# EAGLE design Teensy41Memory (EAGLE 7.4.0)
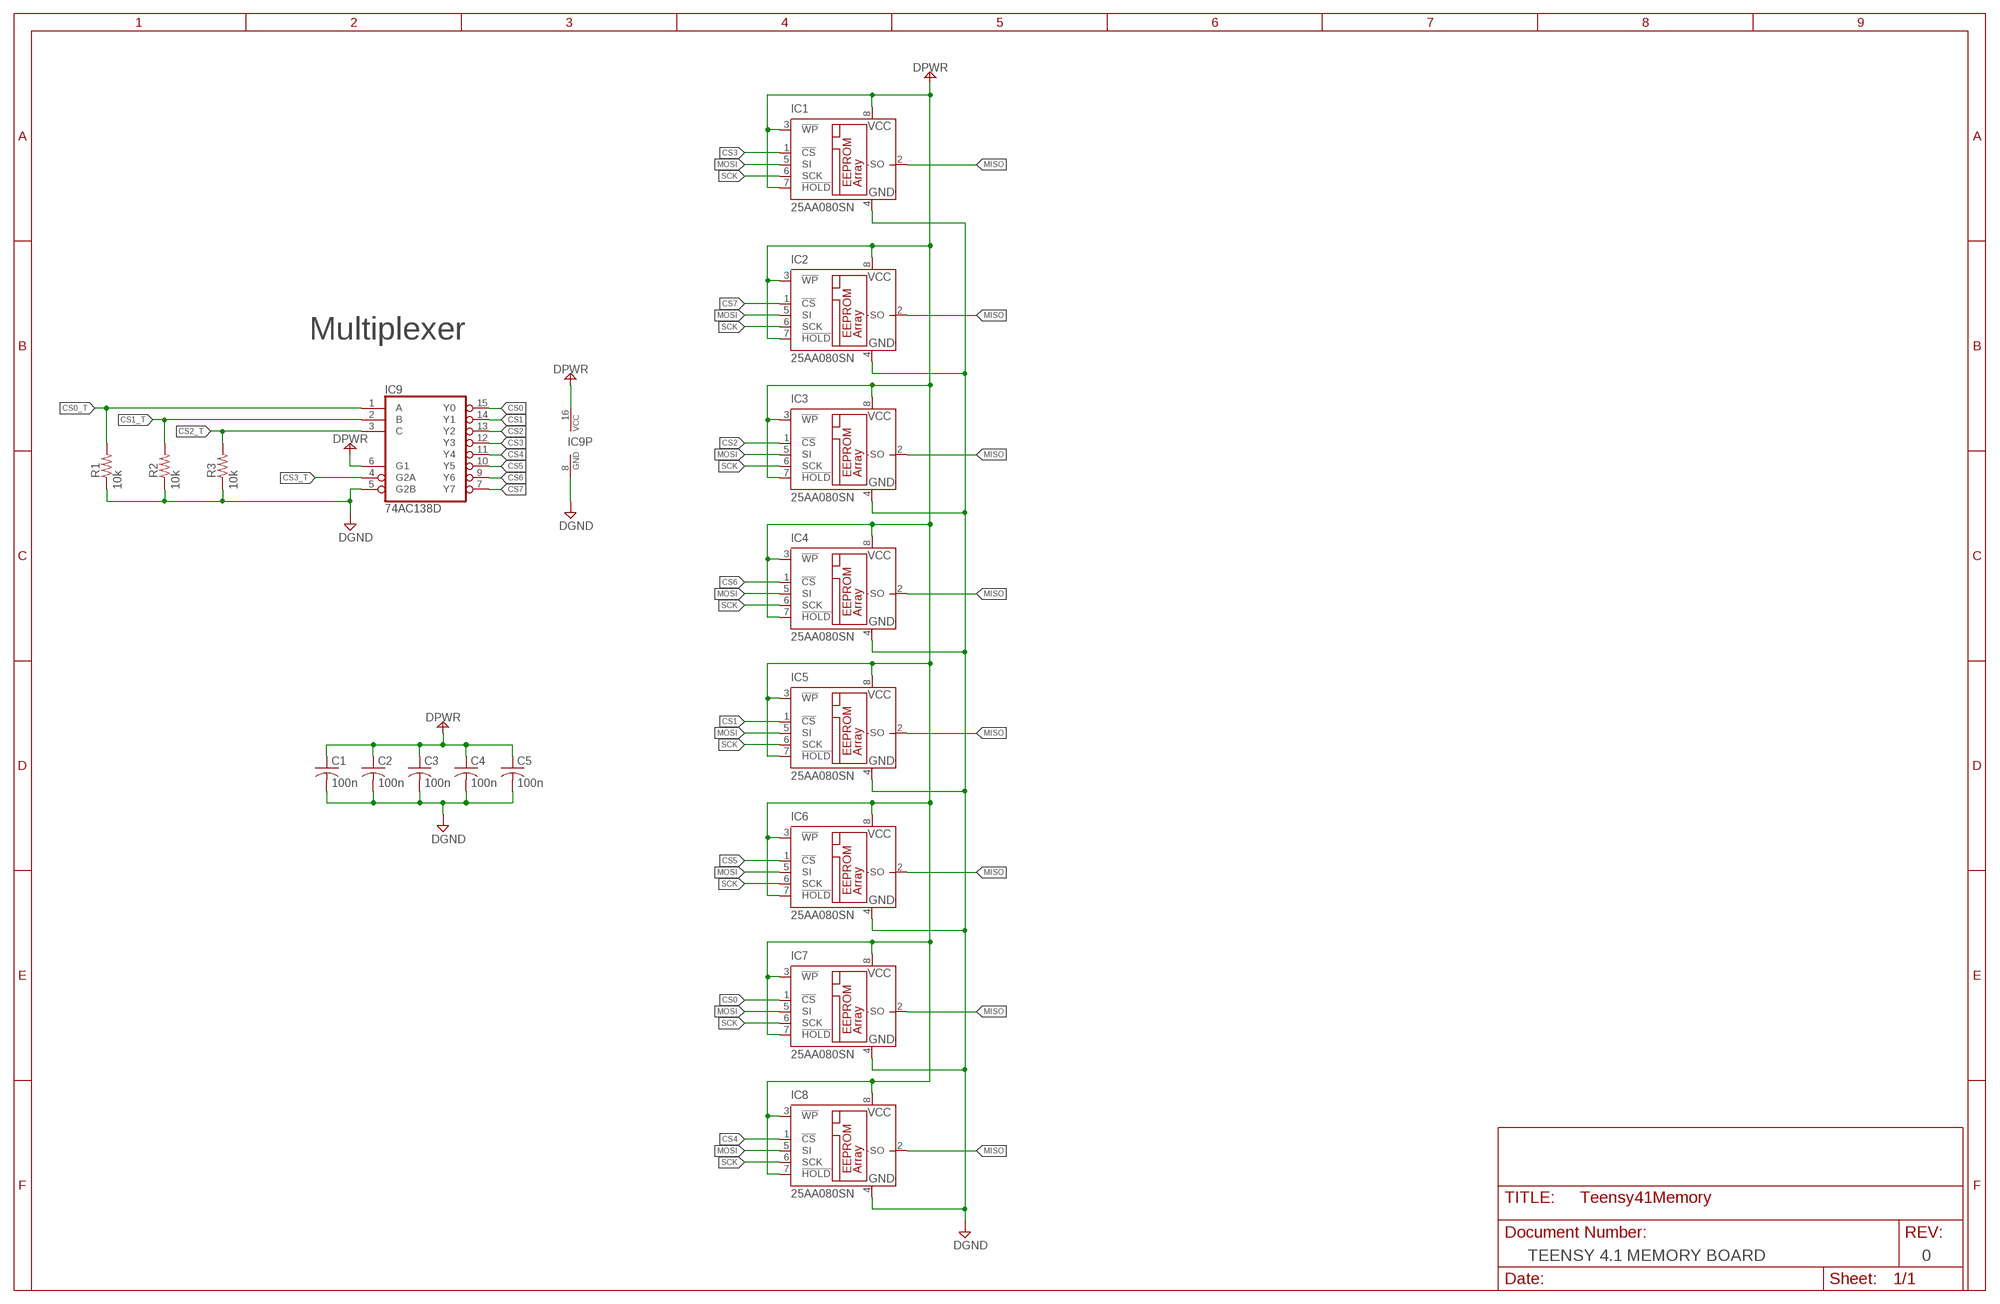
[diagram p0: schematic, sheet 1]

## Parts
C1  100n  CB  [C0603]
C2  100n  CB  [C0603]
C3  100n  CB  [C0603]
C4  100n  CB  [C0603]
C5  100n  CB  [C0603]
IC1  25AA080SN  [SO-08]
IC2  25AA080SN  [SO-08]
IC3  25AA080SN  [SO-08]
IC4  25AA080SN  [SO-08]
IC5  25AA080SN  [SO-08]
IC6  25AA080SN  [SO-08]
IC7  25AA080SN  [SO-08]
IC8  25AA080SN  [SO-08]
IC9  74AC138D  [SO16]
R1  10k  RB  [R0603]
R2  10k  RB  [R0603]
R3  10k  RB  [R0603]

## Nets
CS0: IC7.1(!CS) IC9.15(Y0)
CS0_T: IC9.1(A) R1.2
CS1: IC5.1(!CS) IC9.14(Y1)
CS1_T: IC9.2(B) R2.2
CS2: IC3.1(!CS) IC9.13(Y2)
CS2_T: IC9.3(C) R3.2
CS3: IC1.1(!CS) IC9.12(Y3)
CS3_T: IC9.4(G2A)
CS4: IC8.1(!CS) IC9.11(Y4)
CS5: IC6.1(!CS) IC9.10(Y5)
CS6: IC4.1(!CS) IC9.9(Y6)
CS7: IC2.1(!CS) IC9.7(Y7)
DGND: C1.2 C2.2 C3.2 C4.2 C5.2 IC1.4(GND) IC2.4(GND) IC3.4(GND) IC4.4(GND) IC5.4(GND) IC6.4(GND) IC7.4(GND) IC8.4(GND) IC9.5(G2B) IC9.8(GND) R1.1 R2.1 R3.1
DPWR: C1.1 C2.1 C3.1 C4.1 C5.1 IC1.3(!WP) IC1.7(!HOLD) IC1.8(VCC) IC2.3(!WP) IC2.7(!HOLD) IC2.8(VCC) IC3.3(!WP) IC3.7(!HOLD) IC3.8(VCC) IC4.3(!WP) IC4.7(!HOLD) IC4.8(VCC) IC5.3(!WP) IC5.7(!HOLD) IC5.8(VCC) IC6.3(!WP) IC6.7(!HOLD) IC6.8(VCC) IC7.3(!WP) IC7.7(!HOLD) IC7.8(VCC) IC8.3(!WP) IC8.7(!HOLD) IC8.8(VCC) IC9.6(G1) IC9.16(VCC)
MISO: IC1.2(SO) IC2.2(SO) IC3.2(SO) IC4.2(SO) IC5.2(SO) IC6.2(SO) IC7.2(SO) IC8.2(SO)
MOSI: IC1.5(SI) IC2.5(SI) IC3.5(SI) IC4.5(SI) IC5.5(SI) IC6.5(SI) IC7.5(SI) IC8.5(SI)
SCK: IC1.6(SCK) IC2.6(SCK) IC3.6(SCK) IC4.6(SCK) IC5.6(SCK) IC6.6(SCK) IC7.6(SCK) IC8.6(SCK)

## Notes on the sheet
- Multiplexer
- TEENSY 4.1 MEMORY BOARD | 0

## Library data of the parts
C1-C5 = studio_h:C: Non-Polarized Capacitor; Z_SMT: Y
IC1-IC8 = microchip:25*: Serial EEPROM 4K/ 8K , SPI bus; MF: MICROCHIP; MPN: 25AA080/SN; OC_FARNELL: 1816072; OC_NEWARK: 92C7351
IC9 = 74xx-eu:74*138: 3-line to 8-line DECODER/DEMULTIPLEXER
R1-R3 = studio_h:R: Resistor; Z_SMT: Y

## Net classes
0 Signal: width 0.254 mm, clearance 0.205 mm
1 Power: width 0.508 mm, clearance 0.205 mm to class 0, clearance 0.205 mm
2 GND: width 0.889 mm

## Board
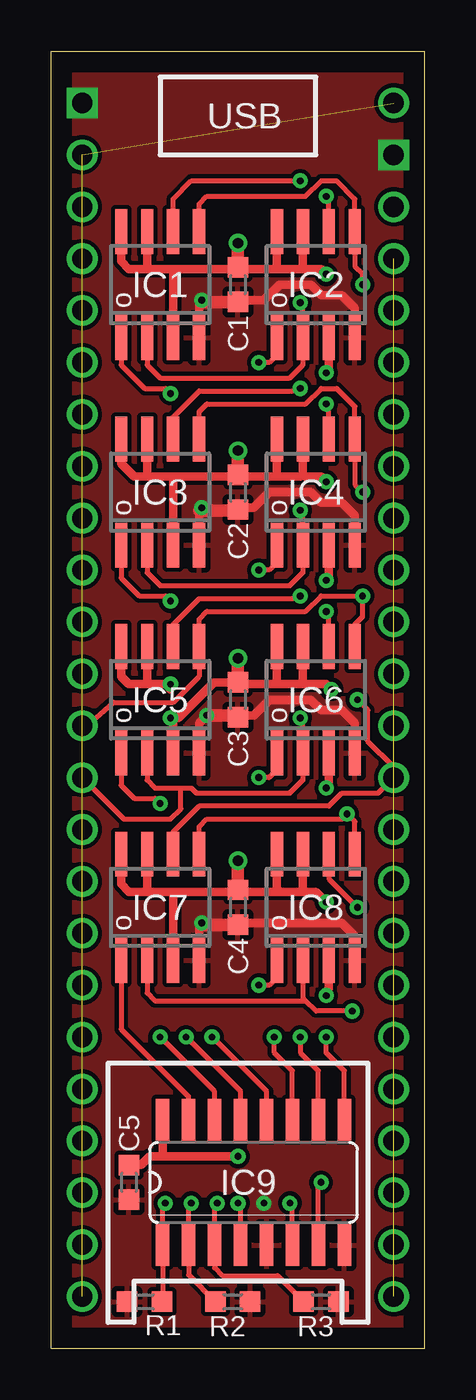
[diagram p1: board, top side]
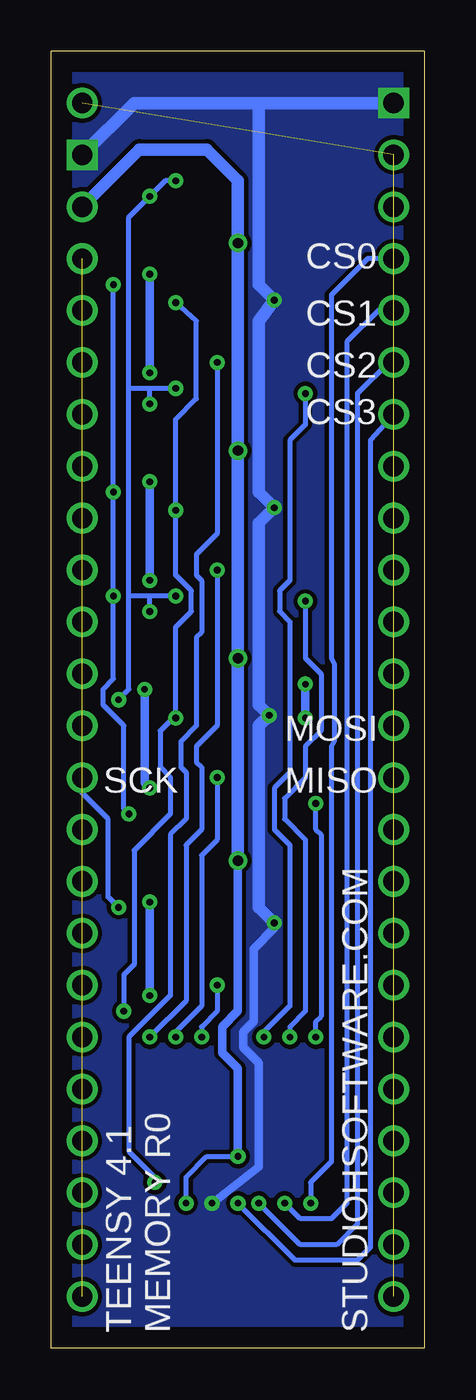
[diagram p2: board, bottom side, seen from below]

Size 18.29 x 63.5 mm. Coordinates in mm from the lower left corner, seen from the top.
Outline: 0,0 18.29,0 18.29,63.5 0,63.5 0,0
Copper layers (1*16): Top 0.035mm / dielectric 0.2mm / Bottom 0.035mm
Design rules "default *": minimum track width 10mil, minimum drill 20mil, track to track 8mil, track to pad 8mil, pad to pad 8mil, via to via 8mil, smd to smd 8mil, copper to edge 40mil, drill to drill 8mil, minimum pad ring 10mil, minimum via ring 8mil, stop-mask expansion 4mil, vias tented up to drill 0mil, thermal gap 10mil
bKeepout: area 20.6,155.1 to 26.9,165.3
bRestrict: area 20.6,155.1 to 26.9,165.3

### Footprints (pad centres in the part's own frame; a part is rotated, then mirrored left to right if it is on the bottom)
C0603 = smd 1 x 1: 1 -0.85,0; 2 0.85,0
SO-08 = smd 0.6 x 2.2: 1 -1.905,-2.6; 2 -0.635,-2.6; 3 0.635,-2.6; 4 1.905,-2.6; 5 1.905,2.6; 6 0.635,2.6; 7 -0.635,2.6; 8 -1.905,2.6
SO16 = smd 0.66 x 2.032: 1 -4.445,-3.073; 2 -3.175,-3.073; 3 -1.905,-3.073; 4 -0.635,-3.073; 5 0.635,-3.073; 6 1.905,-3.073; 7 3.175,-3.073; 8 4.445,-3.073; 9 4.445,3.073; 10 3.175,3.073; 11 1.905,3.073; 12 0.635,3.073; 13 -0.635,3.073; 14 -1.905,3.073; 15 -3.175,3.073; 16 -4.445,3.073
R0603 = smd 1 x 1: 1 -0.85,0; 2 0.85,0

### Placement (x,y rotation side)
C1  9.14,52.07 270 top
C2  9.14,41.91 270 top
C3  9.14,31.75 270 top
C4  9.14,21.59 270 top
C5  3.81,8.13 270 top
IC1  5.33,52.07 0 top
IC2  12.95,52.07 0 top
IC3  5.33,41.91 0 top
IC4  12.95,41.91 0 top
IC5  5.33,31.75 0 top
IC6  12.95,31.75 0 top
IC7  5.33,21.59 0 top
IC8  12.95,21.59 0 top
IC9  9.91,8.13 0 top
R1  4.57,2.29 0 top
R2  8.89,2.29 180 top
R3  13.21,2.29 180 top
U$1  [A64CBI]  66.42,95.25 0 bottom  (outside the outline)
U$2  [W64CBI]  69.6,95.25 0 bottom  (outside the outline)
U$3  [V64CBI]  63.5,95.25 0 bottom  (outside the outline)
U$4  [E64CBI]  61.21,95.25 0 bottom  (outside the outline)
U$5  [E64CBI]  59.56,91.19 0 bottom  (outside the outline)
U$6  [S64CBI]  69.85,91.19 0 bottom  (outside the outline)
U$7  [H64CBI]  67.31,91.19 0 bottom  (outside the outline)
U$8  [A64CBI]  64.77,91.19 0 bottom  (outside the outline)
U$9  [P64CBI]  61.98,91.19 0 bottom  (outside the outline)
U$10  [A64CBI]  13.08,95.25 0 bottom  (outside the outline)
U$11  [W64CBI]  16.26,95.25 0 bottom  (outside the outline)
U$12  [V64CBI]  10.16,95.25 0 bottom  (outside the outline)
U$13  [E64CBI]  7.87,95.25 0 bottom  (outside the outline)
U$14  [E64CBI]  6.22,91.19 0 bottom  (outside the outline)
U$15  [S64CBI]  16.51,91.19 0 bottom  (outside the outline)
U$16  [H64CBI]  13.97,91.19 0 bottom  (outside the outline)
U$17  [A64CBI]  11.43,91.19 0 bottom  (outside the outline)
U$18  [P64CBI]  8.64,91.19 0 bottom  (outside the outline)
U$19  [M64CBI]  102.62,133.86 0 bottom  (outside the outline)
U$20  [O64CBI]  99.19,133.86 0 bottom  (outside the outline)
U$21  [D64CBI]  96.27,133.86 0 bottom  (outside the outline)
U$22  [I64CBI]  102.87,130.05 0 bottom  (outside the outline)
U$23  [N64CBI]  101.6,130.05 0 bottom  (outside the outline)
U$24  [D64CBI]  98.81,130.05 0 bottom  (outside the outline)
U$25  [E64CBI]  96.01,130.05 0 bottom  (outside the outline)
U$26  [X64CBI]  93.73,130.05 0 bottom  (outside the outline)
U$27  [A64CBI]  105.92,155.96 0 bottom  (outside the outline)
U$28  [M64CBI]  50.04,133.86 0 bottom  (outside the outline)
U$29  [O64CBI]  46.61,133.86 0 bottom  (outside the outline)
U$30  [D64CBI]  43.69,133.86 0 bottom  (outside the outline)
U$31  [I64CBI]  50.29,130.05 0 bottom  (outside the outline)
U$32  [N64CBI]  49.02,130.05 0 bottom  (outside the outline)
U$33  [D64CBI]  46.23,130.05 0 bottom  (outside the outline)
U$34  [E64CBI]  43.43,130.05 0 bottom  (outside the outline)
U$35  [X64CBI]  41.15,130.05 0 bottom  (outside the outline)
U$36  [B64CBI]  45.72,155.96 0 bottom  (outside the outline)
U$37  [B64CBI]  51.82,90.17 0 bottom  (outside the outline)
U$38  [A64CBI]  105.16,90.17 0 bottom  (outside the outline)
U$39  [S64CBI]  44.96,141.48 0 bottom  (outside the outline)
U$40  [Y64CBI]  42.42,141.48 0 bottom  (outside the outline)
U$41  [N64CBI]  40.13,141.48 0 bottom  (outside the outline)
U$42  [C64CBI]  37.34,141.48 0 bottom  (outside the outline)
U$43  [N64BI]  30.23,150.11 0 bottom  (outside the outline)
U$44  [O64BI]  27.94,150.11 0 bottom  (outside the outline)
U$45  [T64BI]  25.65,150.11 0 bottom  (outside the outline)
U$46  [E64BI]  24.38,150.11 0 bottom  (outside the outline)
U$47  [O64BI]  21.34,150.11 0 bottom  (outside the outline)
U$48  [N64BI]  19.3,150.11 0 bottom  (outside the outline)
U$49  [H64BI]  26.42,146.3 0 bottom  (outside the outline)
U$50  [A64BI]  24.13,146.3 0 bottom  (outside the outline)
U$51  [R64BI]  22.1,146.3 0 bottom  (outside the outline)
U$52  [D64BI]  20.57,146.3 0 bottom  (outside the outline)
U$53  [S64BI]  22.35,142.49 0 bottom  (outside the outline)
U$54  [O64BI]  20.07,142.49 0 bottom  (outside the outline)
U$55  [F64BI]  17.78,142.49 0 bottom  (outside the outline)
U$56  [T64BI]  16.26,142.49 0 bottom  (outside the outline)
U$57  [M54CBI]  43.56,150.11 0 bottom  (outside the outline)
U$58  [I54CBI]  40.89,150.11 0 bottom  (outside the outline)
U$59  [I54CBI]  37.59,150.11 0 bottom  (outside the outline)
U$60  [D54CBI]  39.88,150.11 0 bottom  (outside the outline)
U$61  [N64BI]  89.66,150.11 0 bottom  (outside the outline)
U$62  [O64BI]  87.38,150.11 0 bottom  (outside the outline)
U$63  [T64BI]  85.09,150.11 0 bottom  (outside the outline)
U$64  [E64BI]  83.82,150.11 0 bottom  (outside the outline)
U$65  [O64BI]  80.77,150.11 0 bottom  (outside the outline)
U$66  [N64BI]  78.74,150.11 0 bottom  (outside the outline)
U$67  [S64BI]  82.04,142.49 0 bottom  (outside the outline)
U$68  [O64BI]  79.76,142.49 0 bottom  (outside the outline)
U$69  [F64BI]  77.47,142.49 0 bottom  (outside the outline)
U$70  [T64BI]  75.95,142.49 0 bottom  (outside the outline)
U$71  [H64BI]  85.85,146.3 0 bottom  (outside the outline)
U$72  [A64BI]  83.57,146.3 0 bottom  (outside the outline)
U$73  [R64BI]  81.53,146.3 0 bottom  (outside the outline)
U$74  [D64BI]  80.01,146.3 0 bottom  (outside the outline)
U$75  [S64CBI]  104.39,141.48 0 bottom  (outside the outline)
U$76  [Y64CBI]  101.85,141.48 0 bottom  (outside the outline)
U$77  [N64CBI]  99.57,141.48 0 bottom  (outside the outline)
U$78  [C64CBI]  96.77,141.48 0 bottom  (outside the outline)
U$79  [M54CBI]  103,150.11 0 bottom  (outside the outline)
U$80  [I54CBI]  100.33,150.11 0 bottom  (outside the outline)
U$81  [I54CBI]  97.03,150.11 0 bottom  (outside the outline)
U$82  [D54CBI]  99.31,150.11 0 bottom  (outside the outline)
U$83  [R64BI]  57.15,159.26 0 bottom  (outside the outline)
U$84  [E64BI]  55.37,159.26 0 bottom  (outside the outline)
U$85  [M64BI]  53.34,159.26 0 bottom  (outside the outline)
U$86  [E64BI]  50.04,155.19 0 bottom  (outside the outline)
U$87  [N64BI]  57.91,155.19 0 bottom  (outside the outline)
U$88  [A64BI]  55.63,155.19 0 bottom  (outside the outline)
U$89  [B64BI]  53.59,155.19 0 bottom  (outside the outline)
U$90  [L64BI]  51.31,155.19 0 bottom  (outside the outline)
U$91  [E64BI]  59.94,155.19 0 bottom  (outside the outline)
U$92  [O64BI]  103.12,146.3 0 bottom  (outside the outline)
U$93  [S64BI]  100.84,146.3 0 bottom  (outside the outline)
U$94  [C64BI]  98.55,146.3 0 bottom  (outside the outline)
U$95  [B54CBI]  96.27,146.3 0 bottom  (outside the outline)
U$96  [O64BI]  43.69,146.3 0 bottom  (outside the outline)
U$97  [S64BI]  41.4,146.3 0 bottom  (outside the outline)
U$98  [C64BI]  39.12,146.3 0 bottom  (outside the outline)
U$99  [O64CBI]  105.16,83.57 0 bottom  (outside the outline)
U$100  [W64BI]  58.17,35.05 0 bottom  (outside the outline)
U$101  [A64BI]  55.37,35.05 0 bottom  (outside the outline)
U$102  [V64BI]  53.09,35.05 0 bottom  (outside the outline)
U$103  [E64BI]  51.05,35.05 0 bottom  (outside the outline)
U$104  [A64BI]  58.42,29.97 0 bottom  (outside the outline)
U$105  [M64BI]  56.39,29.97 0 bottom  (outside the outline)
U$106  [P64BI]  53.34,29.21 0 bottom  (outside the outline)
U$107  [F64BI]  58.42,24.38 0 bottom  (outside the outline)
U$108  [M64BI]  57.15,24.38 0 bottom  (outside the outline)
U$109  [W64BI]  58.42,73.91 0 bottom  (outside the outline)
U$110  [A64BI]  55.63,73.91 0 bottom  (outside the outline)
U$111  [V64BI]  53.34,73.91 0 bottom  (outside the outline)
U$112  [E64BI]  51.31,73.91 0 bottom  (outside the outline)
U$113  [A64BI]  56.64,68.83 0 bottom  (outside the outline)
U$114  [M64BI]  54.61,68.83 0 bottom  (outside the outline)
U$115  [P64BI]  51.56,68.07 0 bottom  (outside the outline)
U$116  [F64BI]  54.1,63.25 0 bottom  (outside the outline)
U$117  [M64BI]  52.83,63.25 0 bottom  (outside the outline)
U$118  [M64CBI]  60.45,82.04 0 bottom  (outside the outline)
U$119  [O64CBI]  57.02,82.04 0 bottom  (outside the outline)
U$120  [D64CBI]  54.1,82.04 0 bottom  (outside the outline)
U$121  [T64CBI]  59.44,78.23 0 bottom  (outside the outline)
U$122  [Y64CBI]  56.9,78.23 0 bottom  (outside the outline)
U$123  [P64CBI]  54.36,78.23 0 bottom  (outside the outline)
U$124  [E64CBI]  51.82,78.23 0 bottom  (outside the outline)
U$125  [M64CBI]  57.91,43.18 0 bottom  (outside the outline)
U$126  [O64CBI]  54.48,43.18 0 bottom  (outside the outline)
U$127  [D64CBI]  51.56,43.18 0 bottom  (outside the outline)
U$128  [T64CBI]  56.9,39.37 0 bottom  (outside the outline)
U$129  [Y64CBI]  54.36,39.37 0 bottom  (outside the outline)
U$130  [P64CBI]  51.82,39.37 0 bottom  (outside the outline)
U$131  [E64CBI]  49.28,39.37 0 bottom  (outside the outline)
U$132  [CV-WHEEL-MED]  39.62,113.51 0 bottom  (outside the outline)
U$133  [CV-WHEEL-MED]  14.61,124.46 0 bottom  (outside the outline)
U$134  [A54CBI]  36.83,146.3 0 bottom  (outside the outline)
U$135  [S64CBI]  102.36,83.57 0 bottom  (outside the outline)
U$136  [C64CBI]  99.82,83.57 0 bottom  (outside the outline)
U$137  [I64CBI]  97.28,83.57 0 bottom  (outside the outline)
U$138  [L64CBI]  96.01,83.57 0 bottom  (outside the outline)
U$139  [L64CBI]  93.73,83.57 0 bottom  (outside the outline)
U$140  [A64CBI]  91.44,83.57 0 bottom  (outside the outline)
U$141  [T64CBI]  88.65,83.57 0 bottom  (outside the outline)
U$142  [O64CBI]  86.36,83.57 0 bottom  (outside the outline)
U$143  [R64CBI]  83.57,83.57 0 bottom  (outside the outline)
U$144  [A64CBI]  79.5,83.57 0 bottom  (outside the outline)
U$145  [O64CBI]  43.69,83.57 0 bottom  (outside the outline)
U$146  [S64CBI]  40.89,83.57 0 bottom  (outside the outline)
U$147  [C64CBI]  38.35,83.57 0 bottom  (outside the outline)
U$148  [I64CBI]  35.81,83.57 0 bottom  (outside the outline)
U$149  [L64CBI]  34.54,83.57 0 bottom  (outside the outline)
U$150  [L64CBI]  32.26,83.57 0 bottom  (outside the outline)
U$151  [A64CBI]  29.97,83.57 0 bottom  (outside the outline)
U$152  [T64CBI]  27.18,83.57 0 bottom  (outside the outline)
U$153  [O64CBI]  24.89,83.57 0 bottom  (outside the outline)
U$154  [R64CBI]  22.1,83.57 0 bottom  (outside the outline)
U$155  [B64CBI]  18.03,83.57 0 bottom  (outside the outline)
U$156  [CV-WHEEL-MED]  68.33,124.46 0 bottom  (outside the outline)
U$157  [CV-WHEEL-MED]  93.47,113.51 0 bottom  (outside the outline)
U$158  [CV-WHEEL-SM1]  94.49,31.75 0 bottom  (outside the outline)
U$159  [CV-WHEEL-LARGE]  23.02,60.33 0 bottom  (outside the outline)
U$160  [CV-WHEEL-SM1]  31.75,31.75 0 bottom  (outside the outline)
U$161  [CV-WHEEL-SM2]  10.32,31.75 0 bottom
U$162  [F64BI]  105.92,14.99 0 bottom  (outside the outline)
U$163  [M64BI]  104.65,14.99 0 bottom  (outside the outline)
U$164  [I64BI]  104.65,11.43 0 bottom  (outside the outline)
U$165  [N64BI]  103.38,11.43 0 bottom  (outside the outline)
U$166  [C64BI]  84.33,14.99 0 bottom  (outside the outline)
U$167  [V64BI]  82.04,14.99 0 bottom  (outside the outline)
U$168  [I64BI]  83.06,11.43 0 bottom  (outside the outline)
U$169  [N64BI]  81.79,11.43 0 bottom  (outside the outline)
U$170  [F64BI]  43.18,14.99 0 bottom  (outside the outline)
U$171  [M64BI]  41.91,14.99 0 bottom  (outside the outline)
U$172  [I64BI]  41.91,11.43 0 bottom  (outside the outline)
U$173  [N64BI]  40.64,11.43 0 bottom  (outside the outline)
U$174  [C64BI]  21.59,14.99 0 bottom  (outside the outline)
U$175  [V64BI]  19.3,14.99 0 bottom
U$176  [I64BI]  20.32,11.43 0 bottom
U$177  [N64BI]  19.05,11.43 0 bottom
U$178  [TARGET]  9.53,5.08 0 bottom
U$179  [TARGET]  98.42,5.08 0 bottom  (outside the outline)
U$180  [TARGET]  98.42,172.72 0 bottom  (outside the outline)
U$181  [TARGET]  9.53,172.72 0 bottom  (outside the outline)
U$182  [TARGET]  9.53,162.32 0 bottom  (outside the outline)
U$183  [TARGET]  94.46,31.75 0 bottom  (outside the outline)
U$184  [TARGET]  23.81,162.32 0 bottom  (outside the outline)
U$185  [TARGET]  38.1,162.32 0 bottom  (outside the outline)
U$186  [TARGET]  69.85,162.32 0 bottom  (outside the outline)
U$187  [TARGET]  84.14,162.32 0 bottom  (outside the outline)
U$188  [TARGET]  98.42,162.32 0 bottom  (outside the outline)
U$189  [TARGET]  10.48,105.41 0 bottom  (outside the outline)
U$190  [TARGET]  35.56,95.22 0 bottom  (outside the outline)
U$191  [TARGET]  64.33,105.41 0 bottom  (outside the outline)
U$192  [TARGET]  89.79,95.22 0 bottom  (outside the outline)
U$193  [TARGET]  10.32,15.88 0 bottom
U$194  [TARGET]  31.75,15.88 0 bottom  (outside the outline)
U$195  [TARGET]  73.03,15.88 0 bottom  (outside the outline)
U$196  [TARGET]  94.46,15.88 0 bottom  (outside the outline)
U$197  [TARGET]  8.73,147.24 0 bottom  (outside the outline)
U$198  [TARGET]  53.98,147.34 0 bottom  (outside the outline)
U$199  [TARGET]  68.26,147.24 90 bottom  (outside the outline)
U$200  [TARGET]  53.98,54.9 0 bottom  (outside the outline)
U$201  [TARGET]  53.98,15.88 0 bottom  (outside the outline)
U$202  [TARGET]  33.34,151.01 0 bottom  (outside the outline)
U$203  [TARGET]  29.37,147.24 0 bottom  (outside the outline)
U$204  [TARGET]  25.4,143.47 0 bottom  (outside the outline)
U$205  [TARGET]  92.87,151.01 0 bottom  (outside the outline)
U$206  [TARGET]  88.9,147.24 0 bottom  (outside the outline)
U$207  [TARGET]  84.93,143.47 0 bottom  (outside the outline)
U$208  [TARGET]  62.23,74.93 0 bottom  (outside the outline)
U$209  [TARGET]  59.69,69.68 0 bottom  (outside the outline)
U$210  [TARGET]  57.15,64.42 0 bottom  (outside the outline)
U$211  [TARGET]  45.72,35.91 0 bottom  (outside the outline)
U$212  [TARGET]  48.26,30.65 0 bottom  (outside the outline)
U$213  [TARGET]  50.8,25.4 0 bottom  (outside the outline)
U$214  [TARGET]  53.98,165.07 0 bottom  (outside the outline)
U$215  [TARGET]  85.09,133.35 0 bottom  (outside the outline)
U$216  [TARGET]  32.51,133.35 0 bottom  (outside the outline)
U$217  [TARGET]  25.4,50.48 0 bottom  (outside the outline)
U$218  [TARGET]  84.93,50.48 0 bottom  (outside the outline)
U$219  [TARGET]  14.61,124.46 0 bottom  (outside the outline)
U$220  [TARGET]  39.62,113.54 0 bottom  (outside the outline)
U$221  [TARGET]  68.33,124.46 0 bottom  (outside the outline)
U$222  [TARGET]  93.47,113.54 0 bottom  (outside the outline)
U$223  [TARGET]  10.03,81.79 0 bottom  (outside the outline)
U$224  [TARGET]  69.09,81.79 0 bottom  (outside the outline)
U$225  [TARGET]  86.01,60.33 0 bottom  (outside the outline)
U$226  [TARGET]  23.02,60.33 0 bottom  (outside the outline)
U$227  [TARGET]  10.32,31.75 0 bottom
U$228  [TARGET]  31.75,31.75 0 bottom  (outside the outline)
U$229  [TARGET]  73.03,31.75 0 bottom  (outside the outline)
U$230  [D48CB]  84.33,172.97 0 bottom  (outside the outline)
U$231  [U48CB]  82.3,172.97 0 bottom  (outside the outline)
U$232  [A48CB]  80.52,172.97 0 bottom  (outside the outline)
U$233  [L48CB]  78.23,172.97 0 bottom  (outside the outline)
U$234  [O48CB]  41.91,172.97 0 bottom  (outside the outline)
U$235  [S48CB]  39.62,172.97 0 bottom  (outside the outline)
U$236  [C48CB]  37.59,172.97 0 bottom  (outside the outline)
U$237  [I48CB]  35.31,172.97 0 bottom  (outside the outline)
U$238  [L48CB]  34.29,172.97 0 bottom  (outside the outline)
U$239  [L48CB]  32.51,172.97 0 bottom  (outside the outline)
U$240  [A48CB]  30.73,172.97 0 bottom  (outside the outline)
U$241  [T48CB]  28.7,172.97 0 bottom  (outside the outline)
U$242  [O48CB]  26.92,172.97 0 bottom  (outside the outline)
U$243  [R48CB]  24.64,172.97 0 bottom  (outside the outline)
U$244  [P48CB]  71.88,172.97 0 bottom  (outside the outline)
U$245  [R48CB]  70.1,172.97 0 bottom  (outside the outline)
U$246  [O48CB]  68.07,172.97 0 bottom  (outside the outline)
U$247  [G48CB]  65.79,172.97 0 bottom  (outside the outline)
U$248  [R48CB]  63.5,172.97 0 bottom  (outside the outline)
U$249  [A48CB]  61.47,172.97 0 bottom  (outside the outline)
U$250  [M48CB]  59.18,172.97 0 bottom  (outside the outline)
U$251  [M48CB]  56.9,172.97 0 bottom  (outside the outline)
U$252  [A48CB]  54.61,172.97 0 bottom  (outside the outline)
U$254  [CV-WHEEL-LARGE]  86.01,60.33 0 bottom  (outside the outline)
U$255  [TARGET]  16.51,43.18 0 bottom
U$256  [TARGET]  79.5,43.18 0 bottom  (outside the outline)
U$257  [B48CB]  52.32,172.97 0 bottom  (outside the outline)
U$258  [L48CB]  50.29,172.97 0 bottom  (outside the outline)
U$259  [E48CB]  48.51,172.97 0 bottom  (outside the outline)

### Tracks (layer width: path | path; a pad name or v marks a point on that pad's centre or on a via)
CS0
  Top 0.254: IC9.15 6.73,12.32 3.43,15.62 IC7.1
CS0_T  (via drill 0.33, 1)
  Top 0.254: v5.59,7.11 5.46,6.99 IC9.1 5.46,2.33 R1.2
  Bottom 0.254: v1.52,53.34 2.79,53.34 4.57,51.56 4.57,33.78 4.45,33.53 4.45,29.72 4.57,29.46 4.57,9.14 5.59,8.13 v5.59,7.11
CS1  (via drill 0.33)
  Top 0.254: IC9.14 8,12.57 v5.33,15.24 | IC5.1 3.43,27.56 4.06,26.92 5.08,26.92 v5.33,26.67
  Bottom 0.254: v5.33,15.24 5.33,16 5.08,16.26 5.08,25.15 5.33,25.4 v5.33,26.67
CS1_T  (via drill 0.33, 1)
  Top 0.254: v6.86,7.11 6.73,6.99 IC9.2 6.73,3.6 R2.2
  Bottom 0.254: v1.52,50.8 2.29,50.8 3.81,49.28 3.81,7.11 4.57,6.35 6.1,6.35 v6.86,7.11
CS2  (via drill 0.33)
  Top 0.254: v5.84,36.58 5.59,36.83 4.32,36.83 3.43,37.72 IC3.1 | v6.6,15.24 9.27,12.57 IC9.13
  Bottom 0.254: v5.84,36.58 5.84,33.78 5.08,33.02 5.08,30.23 5.84,29.46 5.84,27.94 6.86,26.92 6.86,25.91 5.84,24.89 5.84,16.51 6.6,15.75 v6.6,15.24
CS2_T  (via drill 0.33, 1)
  Top 0.254: v8.13,7.11 8,6.99 IC9.3 8,3.94 8.38,3.56 11.09,3.56 R3.2
  Bottom 0.254: v1.52,48.26 1.78,48.26 3.3,46.74 3.3,6.1 4.32,5.08 6.1,5.08 v8.13,7.11
CS3  (via drill 0.33)
  Top 0.254: IC1.1 3.43,48.13 4.57,46.99 5.59,46.99 v5.84,46.74 | v7.87,15.24 10.54,12.57 IC9.12
  Bottom 0.254: v5.84,46.74 5.84,45.21 6.6,44.45 6.6,37.59 7.11,37.08 7.11,36.07 6.6,35.56 6.6,28.19 7.37,27.43 7.37,25.4 6.6,24.64 6.6,16.76 7.87,15.49 v7.87,15.24
CS3_T  (via drill 0.33, 1)
  Top 0.254: IC9.4 9.27,6.99 v9.14,7.11
  Bottom 0.254: v1.52,45.72 2.67,44.45 2.67,4.95 3.3,4.32 6.35,4.32 v9.14,7.11
CS4  (via drill 0.33)
  Top 0.254: IC8.1 11.05,18.16 10.67,17.78 v10.16,17.78 | IC9.11 11.81,13.59 10.92,14.48 v10.92,15.24
  Bottom 0.254: v10.16,17.78 10.16,16.51 10.92,15.75 v10.92,15.24
CS5  (via drill 0.33)
  Top 0.254: IC6.1 11.05,28.32 10.67,27.94 v10.16,27.94 | v12.19,15.24 12.19,14.48 13.08,13.59 IC9.10
  Bottom 0.254: v10.16,27.94 10.16,24.89 10.92,24.13 10.92,16.76 12.19,15.49 v12.19,15.24
CS6  (via drill 0.33)
  Top 0.254: IC4.1 11.05,38.48 10.67,38.1 v10.16,38.1 | IC9.9 14.35,13.59 13.46,14.48 v13.46,15.24
  Bottom 0.254: v10.16,38.1 10.16,30.48 11.18,29.46 11.18,28.7 10.92,28.45 10.92,25.4 11.68,24.64 11.68,17.02 v13.46,15.24
CS7  (via drill 0.33)
  Top 0.254: IC9.7 13.08,8 v13.21,8.13 | IC2.1 11.05,48.64 10.67,48.26 v10.16,48.26
  Bottom 0.254: v10.16,48.26 10.16,39.88 11.18,38.86 11.18,37.85 10.92,37.59 10.92,35.05 11.18,34.8 11.18,30.48 11.94,29.72 11.94,28.45 11.68,28.19 11.68,25.91 12.45,25.15 12.45,17.27 14.48,15.24 14.48,9.65 13.21,8.38 v13.21,8.13
DGND  (via drill 0.33, 1)
  Top 0.254: 7.24,51.18 7.24,51.05 7.41,51.22
  Top 0.406: IC1.4 7.24,51.05 | 7.24,51.18 v7.37,51.31 | IC2.4 14.86,50.93 14.22,51.56 13.21,51.56 12.7,52.07 11.18,52.07 10.41,51.31 9.23,51.31 C1.2 | IC3.4 7.24,41.02 | IC7.4 7.24,20.7 v7.37,20.83 | IC4.4 14.86,40.77 14.22,41.4 13.21,41.4 12.7,41.91 10.67,41.91 9.91,41.15 9.23,41.15 C2.2 9.11,41.02 | 9.11,30.86 C3.2 9.23,30.99 9.91,30.99 10.67,31.75 12.7,31.75 13.21,31.24 14.22,31.24 14.86,30.61 IC6.4 | IC8.4 14.86,20.19 14.22,20.83 9.23,20.83 C4.2 | IC5.4 7.24,30.61 v7.62,30.99
  Top 0.61: C1.2 7.41,51.22 | v7.37,41.15 7.24,41.02 9.11,41.02 | C4.2 7.45,20.74 v7.37,20.83 | v7.62,30.99 9.06,30.99 C3.2
  Bottom 0.406: v10.41,7.11 8.13,8.89 8.13,13.97 8.89,14.73 8.89,15.49 8.38,16 8.38,19.56 7.37,20.57 v7.37,20.83
  Bottom 0.61: v1.52,60.96 8.13,60.96 | 8.13,60.96 14.22,60.96 v16.76,58.42 | 8.13,60.96 8.13,52.07 v7.37,51.31 8.13,50.29 8.13,41.91 v7.37,41.15 8.13,40.39 8.13,31.5 v7.62,30.99 8.13,30.48 8.13,21.59 v7.37,20.83
  pour Top: 0.25,63.25 18.03,63.25 18.03,0.25 0.25,0.25
  pour Top: 0.25,63.25 18.03,63.25 18.03,0.25 0.25,0.25
  pour Bottom: 0.25,63.25 18.03,63.25 18.03,0.25 0.25,0.25
DPWR  (via drill 0.33, 0.5, 1)
  Top 0.254: 4.7,52.96 4.57,52.83 | 12.32,52.96 12.19,52.83 | 4.7,42.8 4.83,42.67 | 11.05,42.8 10.92,42.67 | 5.97,52.7 5.84,52.83 | IC9.6 11.81,6.99 v11.68,7.11
  Top 0.406: IC1.8 3.43,53.21 3.81,52.83 4.57,52.83 5.84,52.83 9.06,52.83 | 8.98,53.09 C1.1 9.06,52.83 | IC1.7 4.7,52.96 | IC2.8 11.05,52.96 10.92,52.83 | IC2.7 12.32,52.96 | 10.92,52.83 12.19,52.83 13.21,52.83 v13.46,52.58 | IC3.8 3.43,43.31 4.06,42.67 4.83,42.67 6.1,42.67 | 6.1,42.67 9.06,42.67 C2.1 | 8.98,42.93 C2.1 | IC3.7 4.7,42.8 | IC4.8 11.05,42.8 | 9.31,42.93 C2.1 | IC4.7 12.32,42.8 | 12.32,42.8 12.19,42.67 10.92,42.67 9.23,42.67 C2.1 | IC1.3 5.97,52.7 | v13.46,42.42 13.21,42.67 12.45,42.67 12.32,42.8 | v13.72,32.26 13.46,32.51 12.45,32.51 | 12.45,32.51 11.18,32.51 | 11.18,32.51 9.23,32.51 C3.1 7.96,32.6 6.22,30.86 v5.84,30.86 5.97,30.86 IC5.3 | 4.83,32.51 3.81,32.51 3.43,32.89 IC5.8 | IC5.7 4.7,32.64 4.83,32.51 | IC6.8 11.05,32.64 11.18,32.51 | IC6.7 12.32,32.64 12.45,32.51 | IC2.3 13.59,47.88 v13.46,47.75 | IC4.3 13.59,37.72 v13.46,37.59 | IC6.3 13.59,27.56 v13.46,27.43 | 10.92,52.83 9.06,52.83 | IC7.8 3.43,22.73 3.81,22.35 4.83,22.35 | 4.83,22.35 6.1,22.35 | 6.1,22.35 9.06,22.35 C4.1 9.23,22.35 11.18,22.35 | IC8.3 13.59,17.65 v13.46,17.27 | v13.46,21.84 12.95,22.35 12.19,22.35 | 12.19,22.35 11.18,22.35 | IC8.7 12.32,22.48 12.19,22.35 | IC8.8 11.05,22.48 11.18,22.35 | IC7.7 4.7,22.48 4.83,22.35 | IC3.3 5.97,42.55 6.1,42.67 | IC7.3 5.97,22.23 6.1,22.35 | 5.59,9.4 4.83,9.4 4.41,8.98 C5.1 | 5.59,9.4 v9.14,9.4 | 5.84,32.26 v5.84,32.51 4.83,32.51 | IC9.16 5.46,9.53 5.59,9.4
  Top 0.61: v9.14,54.1 C1.1 | C2.1 v9.14,43.94 | C3.1 v9.14,33.78 | C4.1 v9.14,23.88
  Bottom 0.254: v11.68,7.11 11.68,8.38 10.67,9.4 v9.14,9.4
  Bottom 0.406: v13.46,47.75 v13.46,52.58 | v13.46,37.59 v13.46,42.42 | v13.46,27.43 13.72,27.69 v13.72,32.26 | v13.46,17.27 v13.46,21.84 | v9.14,9.4 9.14,13.72 9.91,14.48 9.91,15.75 9.14,16.51 v9.14,23.88 | v5.84,30.86 v5.84,32.51
  Bottom 0.61: v16.76,55.88 13.97,58.67 10.67,58.67 9.14,57.15 v9.14,54.1 v9.14,43.94 v9.14,33.78 v9.14,23.88
MISO  (via drill 0.33, 1)
  Top 0.254: IC1.2 4.7,48.13 5.33,47.5 11.68,47.5 12.32,48.13 IC2.2 12.32,51.05 v12.19,51.18 | IC3.2 4.7,37.97 5.33,37.34 11.68,37.34 12.32,37.97 IC4.2 12.32,40.89 v12.19,41.02 | IC5.2 4.7,27.81 5.08,27.43 6.35,27.43 | 6.35,27.43 6.86,27.43 7.11,27.18 11.68,27.18 12.32,27.81 IC6.2 12.32,30.73 v12.19,30.86 | IC7.2 4.7,17.4 5.08,17.02 12.45,17.02 | v1.52,27.94 3.56,25.91 5.84,25.91 6.35,26.42 6.35,27.43 | v14.73,16.51 12.95,16.51 12.45,17.02 | IC8.2 12.32,17.14 12.45,17.02
  Bottom 0.254: v12.19,51.18 11.18,50.29 11.18,46.48 12.19,45.47 v12.19,41.02 12.19,37.85 11.43,37.08 11.43,36.07 12.19,35.31 v12.19,30.86 12.32,30.86 12.95,30.23 12.95,28.45 12.45,27.94 12.45,26.16 14.22,24.38 14.22,18.8 14.73,18.29 v14.73,16.51
MOSI  (via drill 0.33, 1)
  Top 0.254: IC1.5 7.24,56.01 7.62,56.39 12.45,56.39 13.21,57.15 13.97,57.15 14.86,56.26 IC2.5 14.86,52.96 15.24,52.58 v15.24,52.07 | IC3.5 7.24,45.85 7.62,46.23 12.45,46.23 13.21,46.99 13.97,46.99 14.86,46.1 IC4.5 14.86,42.29 v15.24,41.91 | IC7.5 7.24,25.53 7.62,25.91 14.22,25.91 v14.48,26.16 14.86,25.78 IC8.5 | v1.52,30.48 1.78,30.48 3.05,31.62 5.97,31.62 7.24,32.89 IC5.5 7.24,35.69 7.62,36.07 12.45,36.07 13.21,36.83 v15.24,36.83 15.24,35.81 14.86,35.43 IC6.5
  Bottom 0.254: v14.48,26.16 14.73,26.42 14.73,30.48 15.75,31.5 15.75,32.26 15.24,32.77 v15.24,36.83 v15.24,41.91 v15.24,52.07
N$4  (via drill 1)  (17 unrouted)
  other vias: 1.52,58.42 1.52,55.88 1.52,43.18 1.52,40.64 1.52,38.1 1.52,35.56 1.52,33.02 1.52,25.4 1.52,22.86 1.52,20.32 1.52,17.78 1.52,15.24 1.52,12.7 1.52,10.16 1.52,7.62 1.52,5.08 1.52,2.54 16.76,60.96
N$5  (via drill 1)  (19 unrouted)
  other vias: 16.76,53.34 16.76,50.8 16.76,48.26 16.76,45.72 16.76,43.18 16.76,40.64 16.76,38.1 16.76,35.56 16.76,33.02 16.76,30.48 16.76,25.4 16.76,22.86 16.76,20.32 16.76,17.78 16.76,15.24 16.76,12.7 16.76,10.16 16.76,7.62 16.76,5.08 16.76,2.54
SCK  (via drill 0.33, 1)
  Top 0.254: IC1.6 5.97,56.26 6.86,57.15 v12.19,57.15 | IC2.6 13.59,56.26 v13.46,56.39 | IC3.6 5.97,45.59 7.24,46.86 11.81,46.86 11.94,46.99 v12.19,46.99 | IC4.6 13.59,46.1 v13.46,46.23 | IC6.6 13.59,35.94 v13.46,36.07 | v12.19,36.83 11.94,36.83 11.81,36.7 7.24,36.7 5.97,35.43 IC5.6 | IC7.6 5.97,25.27 7.24,26.54 13.59,26.54 14.22,27.18 16,27.18 v16.76,27.94 16.76,28.45 15.49,29.72 15.49,31.24 v14.99,31.75 | IC8.6 13.59,22.99 v14.99,21.59
  Bottom 0.254: v12.19,57.15 12.7,57.15 v13.46,56.39 14.48,55.37 14.48,46.99 | 14.48,36.83 14.48,46.99 | v12.19,46.99 13.46,46.99 | 13.46,46.99 14.48,46.99 | v13.46,46.23 13.46,46.99 | v12.19,36.83 13.46,36.83 | 13.46,36.83 14.48,36.83 | v13.46,36.07 13.46,36.83 | v14.99,31.75 14.48,32.26 14.48,36.83 | v14.99,21.59 15.49,22.1 15.49,25.91 16.76,27.18 v16.76,27.94

### Text on the board
tPlace: o | o | o | o | o | o | o | o
tNames: USB
bNames: CS0 | CS1 | CS2 | CS3 | MOSI | MISO | SCK | STUDIOHSOFTWARE.COM | TEENSY 4.1 / MEMORY R0